# Altium schematic sheet rv_pwr_es_relay.SchDoc: RV Essential: Relay Channel
size A4; DocumentNumber: 1; Revision: A; SheetNumber: 2; SheetTotal: 5
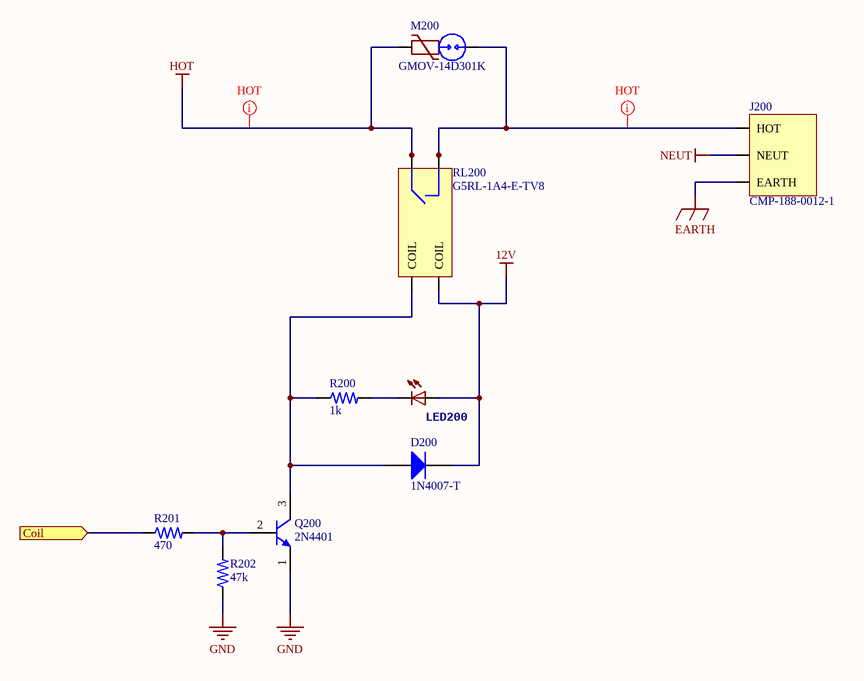
[diagram p0: rv_pwr_es_relay.SchDoc]

## Parts
D200  1N4007-T  [DIOD-DO-41-P-2_V2]
J200  CMP-188-0012-1  [3-213598-2]
LED200  (no value)  [LED5MM]
M200  GMOV-14D301K  [GMOV_14mm]
Q200  2N4401  [ONSC-TO-92-3-29-11]
R200  value 1k  [0207/10]  (hidden comment: 1k TH 0207 5% 0.25W)
R201  value 470  [0207/10]  (hidden comment: 470 TH 0207 5% 0.25W)
R202  value 47k  [0207/10 - Cloned]  (hidden comment: 47k TH 0207 5% 1/4W)
RL200  G5RL-1A4-E-TV8  [G5RL-1A4-E-TV8]

## Ports
Coil (in)

## Nets
12V: D200.2(K) LED200.A RL200.1(COIL)
EARTH: J200.3(EARTH)
GND: Q200.1(E) R202.1
HOT: M200.1(P$1) RL200.4 RL200.5
NEUT: J200.1(NEUT)
Coil: R201.1 ; port Coil
NetD200_1: D200.1(A) Q200.3(C) R200.1 RL200.8(COIL)
NetJ200_2: J200.2(HOT) M200.2(P$2) RL200.3 RL200.6
NetLED200_K: LED200.K(C) R200.2
NetQ200_2: Q200.2(B) R201.2 R202.2

## Layout directives
net class HOT: HOT, NetJ200_2

## Notes on the sheet
- Title
- Size:
- Date:
- A4
- Number:
- Time:
- Revision:
- Sheet
- of
- github.com/blueacro
- blueacro.com
- CERN OHL v1.2
- Made available under the
- File:
- © 2021 StackFoundry LLC. All Rights Reserved.

## Library data of the parts
D200 = CMP-004-00038-1: VR=1000V IF=1A 8pF
LED200 = LED5MM
M200 = CMP-107-0002-1: Source: rcl.SCHLIB; Design Item ID: GMOV
Q200 = CMP-013-00039-2: Transistor NPN Silicon 40V IC=600ma TO-92 Case General Purpose Amplifier And Switch; Collector Emitter Saturation Voltage: 750mV; MF: Rectron; Collector Base Voltage (VCBO): 60V; Package: TO-226-3 Rectron; Availability: In Stock; Value: *; Purchase-URL: https://pricing.snapeda.com/search/part/2N3904/?ref=eda; Case/Package: TO-92; Pin Count: 3; MP: 2N4401; Component Type: Standard; Design Item ID: 2N4401; Collector-emitter Voltage-Max: 40V; SnapEDA_Link: https://www.snapeda.com/parts/2N3904/Rectron/view-part/?ref=snap; Price: None
R200 = CMP-009-00215-2: Res Carbon Film 1K Ohm 5% 1/4W -500ppm/°C to 350ppm/°C Conformal AXL Thru-Hole Paper T/R; Diameter: 2.4mm; Contact Plating: Tin,Matte; Construction: Cylindrical; Case/Package: Conformal
R201 = CMP-009-00217-1: Res Carbon Film 470 Ohm 5% 1/4W -500ppm/°C to 350ppm/°C Conformal AXL Thru-Hole Paper T/R; Construction: Cylindrical; Diameter: 2.4mm; Case/Package: Conformal; Contact Plating: Tin,Matte
R202 = CMP-009-00220-1: Res Carbon Film 47K Ohm 5% 1/4W -500ppm/°C to 350ppm/°C Conformal AXL Thru-Hole Paper T/R; Lead Diameter: 0.55mm; Diameter: 2.4mm; Contact Plating: Tin,Matte; Case/Package: Axial
RL200 = CMP-103-0002-1: Design Item ID: RelaySPST_DT; Source: relay.SchLib
J200 = CMP-188-0012-1: Source: con-tyco.SCHLIB; Design Item ID: 3-213598-2